# Altium schematic sheet 8-Mechanical.SchDoc
size 420 x 297 mm; CompanyName: Microchip Technology Inc.; Organization: Microchip Technology; Address1: 2355 West Chandler Blvd.; Address2: Chandler, AZ  85224; Address4: USA; SheetTitle: **; Time: Time
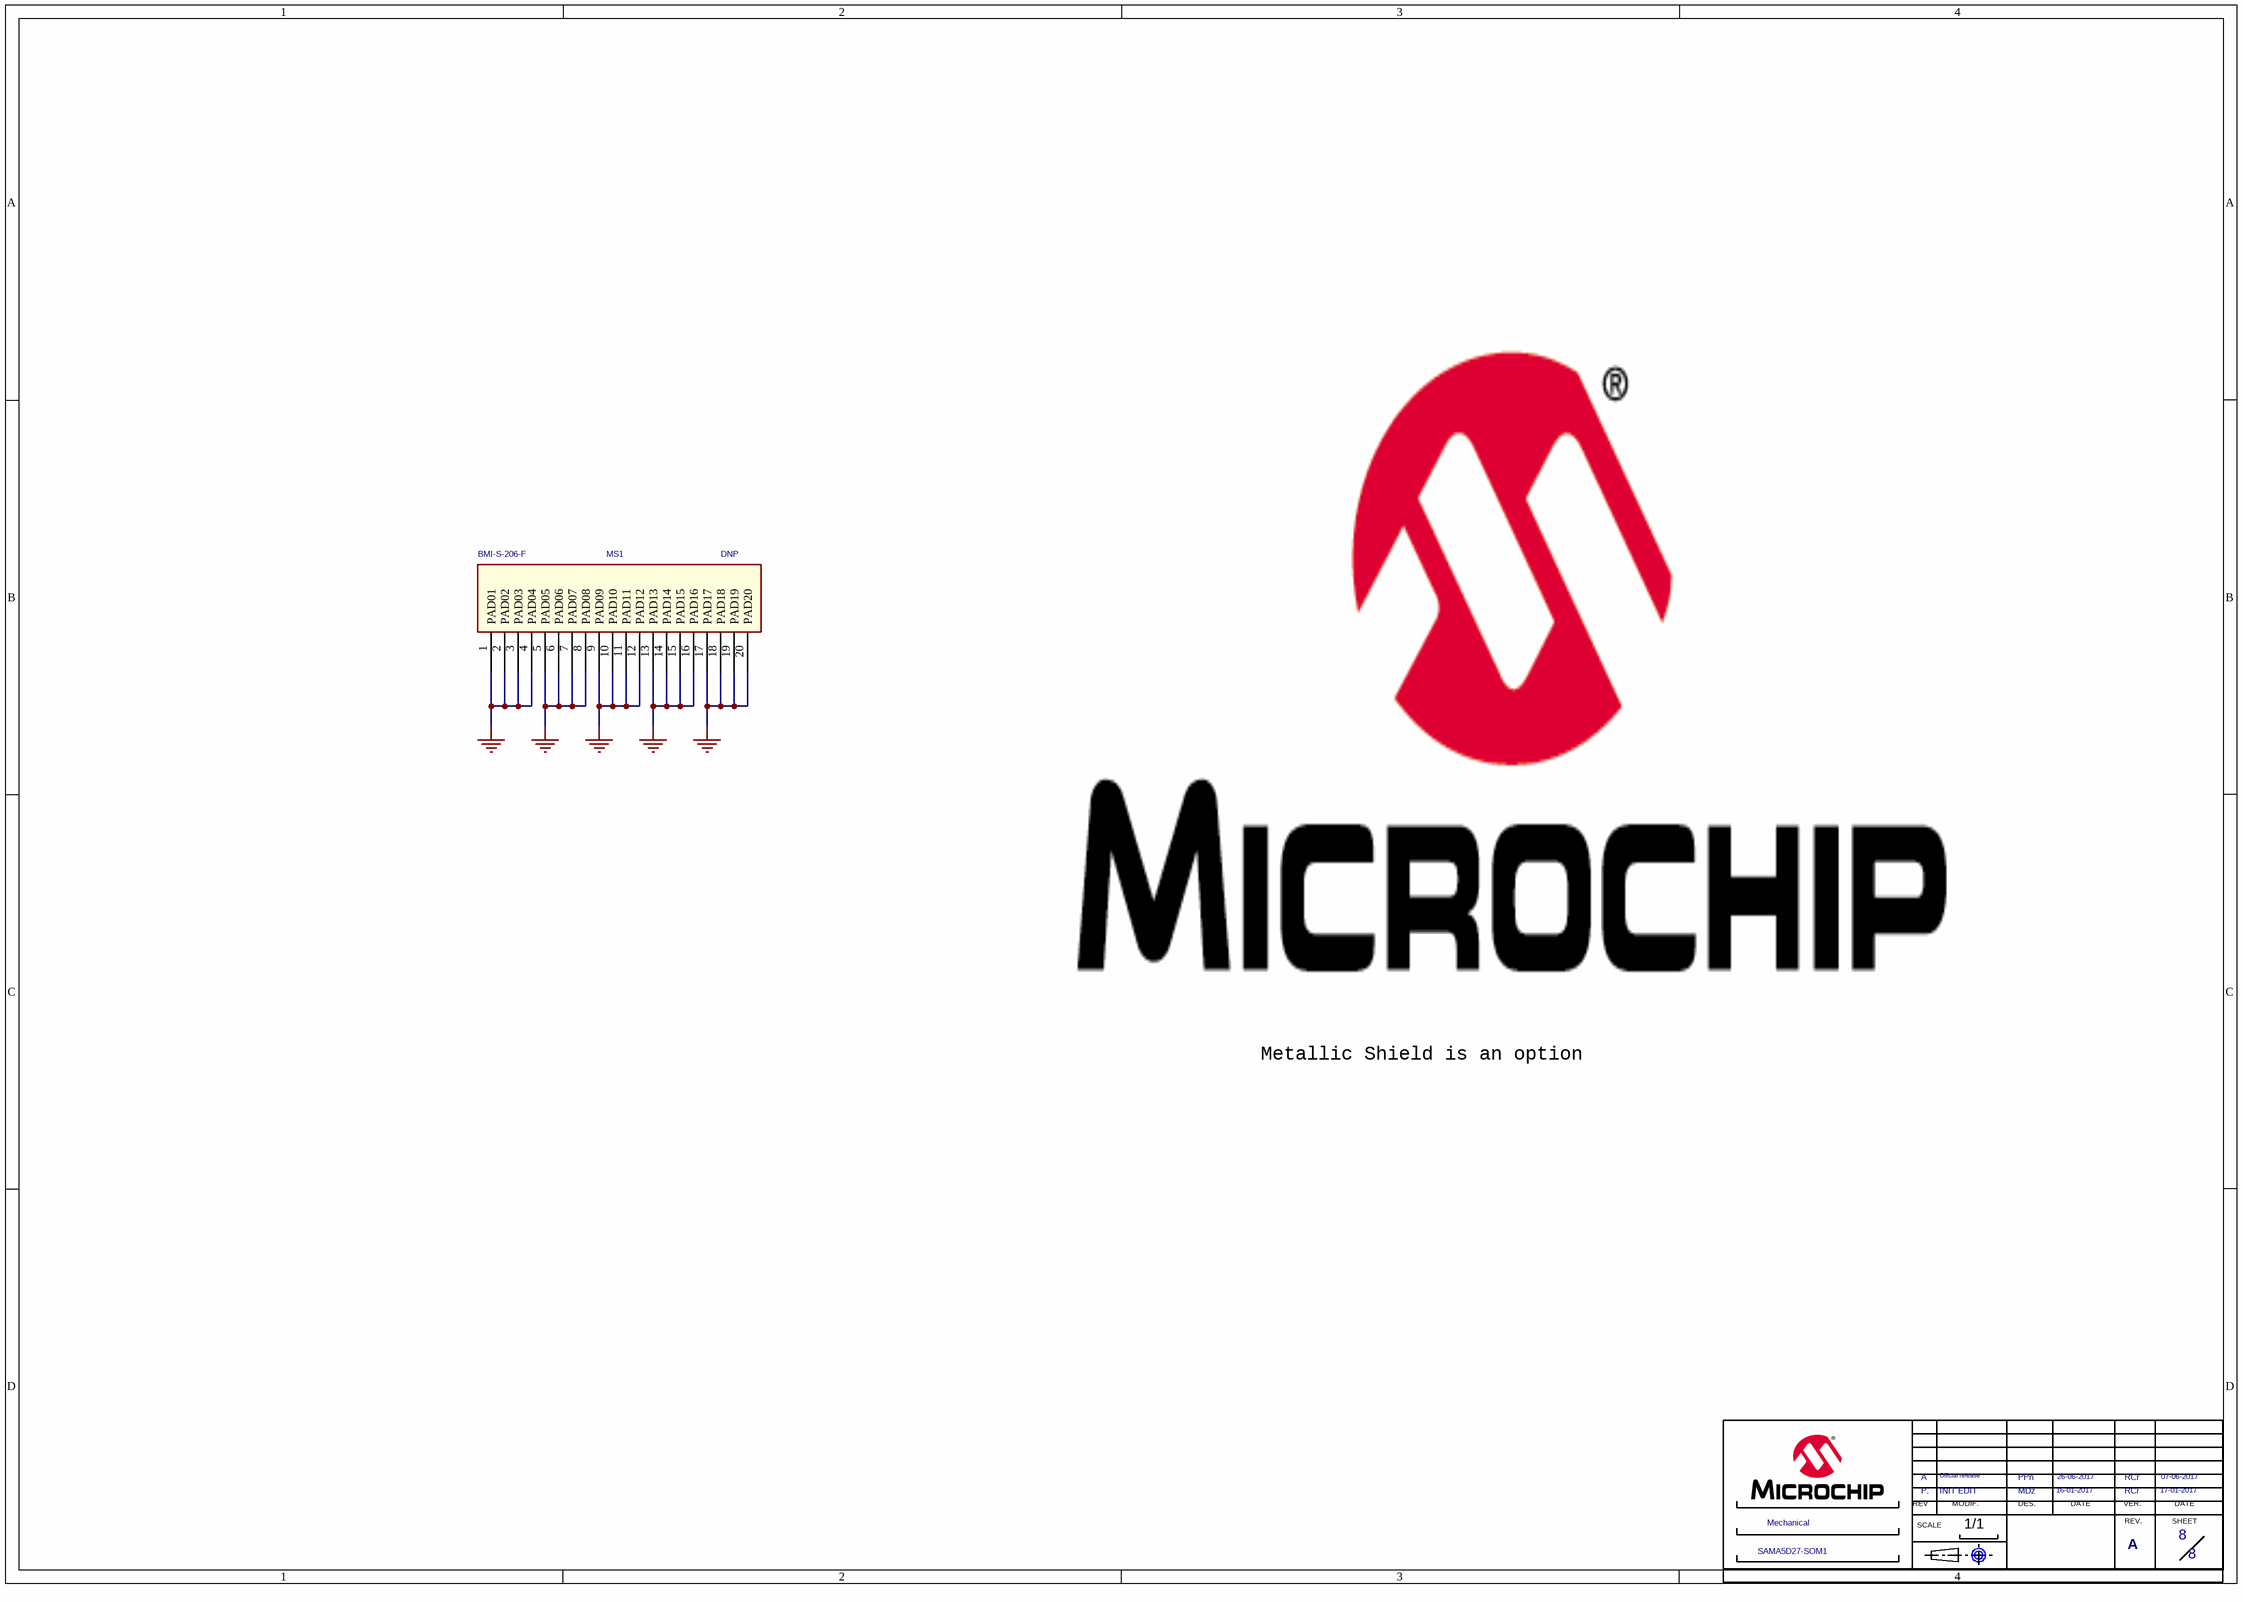
[diagram p0: 8-Mechanical.SchDoc]

## Parts
*  MODIF.A: INIT EDIT  SHEET NAME 2: Mechanical  SHEET NAME 1: SAMA5D27-SOM1  REV B: A  VERIF B: RCr  VERIF DATE A: 17-01-2017  VERIF DATE B: 07-06-2017  Page Count: 8  DATE A: 16-01-2017  DATE B: 26-06-2017  DES A: MDz  DES B: PPn  MODIF.B: Official release  REV A: P.  (hidden comment: CARTOUCHE MICROCHIP)  (graphical)
?  (no value)  (graphical)
MS1  ?  [BMI-S-206-F_01]  (value not drawn)

## Nets
GND: MS1.1(PAD01) MS1.2(PAD02) MS1.3(PAD03) MS1.4(PAD04) MS1.5(PAD05) MS1.6(PAD06) MS1.7(PAD07) MS1.8(PAD08) MS1.9(PAD09) MS1.10(PAD10) MS1.11(PAD11) MS1.12(PAD12) MS1.13(PAD13) MS1.14(PAD14) MS1.15(PAD15) MS1.16(PAD16) MS1.17(PAD17) MS1.18(PAD18) MS1.19(PAD19) MS1.20(PAD20)

## Notes on the sheet
- Metallic Shield is an option
- Drawn By:
- Engineer:
- PartNumber:
- Project Title
- Sheet Title
- Size
- B
- Revision:
- Sch #:
- Date:
- Sheet
- Designed with
- Altium.com <http://go.altium.com/MicrochipLandingPage_Evaluation.html>
- File:
- (in symbol CARTOUCHE MICROCHIP) REV; MODIF.; DES.; DATE; VER.; SCALE; REV.; SHEET; 1/1

## Library data of the parts
* = CARTOUCHE MICROCHIP: REV D: D; REV C: C; REV F: F; REV E: E; VERIF F: XXX; VERIF DATE F: XX-XXX-XX; MODIF.C: RevC; MODIF.D: RevD; MODIF.E: RevE; MODIF.F: RevF; VERIF E: XXX; VERIF D: XXX; VERIF C: RCr; VERIF A: RCr; VERIF DATE E: XX-XXX-XX; VERIF DATE D: XX-XXX-XX; VERIF DATE C: 07-06-2017; REV: A; FT: ?; Page Number: 8; Page Size: A; Page Create Date: june 19, 2004; DATE C: 07-06-2017; DATE D: XX-XXX-XX; DATE E: XX-XXX-XX; DATE F: XX-XXX-XX; DES E: XXX; DES F: XXX; DES C: XXX; DES D: XXX
? = Title Block B
MS1 = BMI-S-206-F: FABRICANT: Laird Technology; DESIGNATION: Metallic shield frame; Valeur: BMI-S-206-F; partnumber: BMI-S-206-F; type: ???; DNP: DNP